# Altium project Sp25-Candle_Maker.PrjPcb
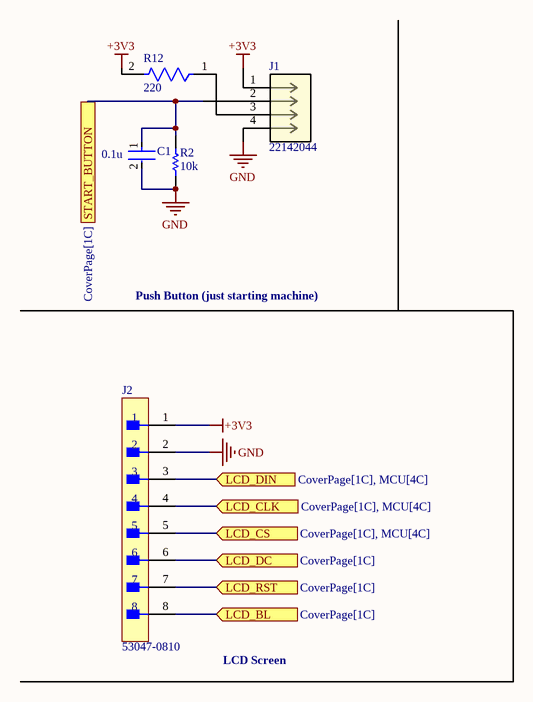
[diagram p0: UI.SchDoc]
5 sheets, 53 parts. Net scope: flat (ports and power ports of the same name join across sheets).
Board file: Candle_Main_PCB.PcbDoc
Sheets:
  UI.SchDoc
  MCU.SchDoc
  VNH5019.SchDoc
  GPIO_EXPANDER_A.SchDoc
  GPIO_EXPANDER_B.SchDoc

## Sheet UI.SchDoc
size A; SheetNumber: 2; SheetTotal: 12

### Parts
C1  0.1u  [FP-CL21-IPC_A]
J1  22142044  [CONN_SDA-4455_04_BE_MOL]
J2  53047-0810  [53047-0810_MFG]
R2  10k  [RESC2013X60X40LL20T25_A]
R12  220  [FP-CRCW0805-e3-MFG]

### Ports
LCD_BL (in, see CoverPage[1C]), LCD_CLK (in, see CoverPage[1C], MCU[4C]), LCD_CS (in, see CoverPage[1C], MCU[4C]), LCD_DC (in, see CoverPage[1C]), LCD_DIN (in, see CoverPage[1C], MCU[4C]), LCD_RST (in, see CoverPage[1C]), START_BUTTON (see CoverPage[1C])

### Nets
+3V3: J1.1 J2.1 R12.2
GND: C1.2 J1.4 J2.2 R2.1
VPSI_CLK: J2.4 ; port LCD_CLK
VSPI_CS: J2.5 ; port LCD_CS
VSPI_MOSI: J2.3 ; port LCD_DIN
NetC1_1: C1.1 J1.2 R2.2 ; port START_BUTTON
NetJ1_3: J1.3 R12.1
NetJ2_6: J2.6 ; port LCD_DC
NetJ2_7: J2.7 ; port LCD_RST
NetJ2_8: J2.8 ; port LCD_BL

### Notes on the sheet
- Push Button (just starting machine)
- LCD Screen

### Library data of the parts
C1 = CMP-13271-000411-1: CL21 Series 0805 100nF 100V ±10% Tolerance X7R Multilayer Ceramic Chip Capacitor
J1 = CMP-129-000000-1: No Description Available; Mfr_Name: Molex Connector Corporation; Design Item ID: 22142044; Type: Type; RefDes: RefDes; Source: 22142044.SchLib
J2 = CMP-00257-00276778-1: Conn Shrouded Header (4 Sides) HDR 8 POS 1.25mm Solder ST Top Entry Thru-Hole PicoBlade Tray; Manufacturer Lifecycle Status: ACTIVE; Gender: Male; Glow Wire Compliant: Non-compliant; Current Rating: 1A; Number of Positions: 8; Contact Resistance: 20mΩ; Insulation Resistance: 100MΩ; Plating: Tin; Voltage Rating (DC): 125V; Number of Circuits: 7; Schedule B: 8536694040, 8536694040; Max Operating Temperature: 85°C; Housing Material: Polyamide; Pitch: 1.25mm; Number of Rows: 1; ComponentLink1URL: http://molex.com; Country of Origin: MX; Case/Package: 0810; Height: 4.4mm; Housing Color: Natural; Flammability Rating: UL94 V-0; Orientation: Vertical; ComponentLink3Description: Manufacturer's Package Drawing; Mount: Through Hole; Min Operating Temperature: -40°C; Number of Pins: 8; Radiation Hardening: No; Contact Plating: Tin; Lead Pitch: 1.25mm; China RoHS: Compliant; ComponentLink1Description: Manufacturer's Website; Lead Free: Lead Free; ComponentLink2Description: Datasheet URL; RoHS: Compliant; Voltage Rating (AC): 125V; ComponentLink3URL: https://www.molex.com/content/dam/molex/molex-dot-com/products/automated/en-us/salesdrawingpdf/530/53047/530470810_sd.pdf?inline; Color: Natural; Number of Contacts: 8; Lifecycle Status: Production; HelpURL: https://www.molex.com/en-us/products/part-detail/530470810#part-details; ComponentLink2URL: https://www.molex.com/en-us/products/part-detail/530470810#part-details; REACH SVHC: Unknown; Contact Material: Tin; Termination: Through Hole; Voltage Rating: 125V
R2 = CMP-2001-00582-2: Metal Film Chip Resistor, High Reliability Type, 0.125 W, +/- 0.1%, -55 to 155 degC, 0805 (2012 Metric), RoHS, Tape and Reel; Voltage Rating: 100V; Power Rating: 125mW(1/8W); Brand: Panasonic; Temperature Coefficient: 25PPM/C; Resistance: 10kOhms; Product Category: ThinFilmResistors-SMD; Datasheet Version: 02/2016; Operating Temperature Range: -55Cto+155C; Length: 2mm; Mounting Technology: SurfaceMount; Manufacturer URL: http://www.panasonic.com/; Width: 1.25mm; Packaging: Reel; Product: ThinFilmResistorsSMD; Package / Case: 0805(2012metric); Termination Style: SMD/SMT; Tolerance: 0.1%; Datasheet URL: https://industrial.panasonic.com/cdbs/www-data/pdf/RDM0000/AOA0000C307.pdf; Package Description: 2-Pin Surface Mount Device, Body 2 x 1.25 mm; Factory Pack Quantity: 5000; Series: ERA-6A; Case Code - mm: 2012; RoHS: Details; Package Reference: 0805; Height: 0.5mm; Manufacturer: Panasonic; Case Code - in: 0805; Type: MetalFilmChipResistors
R12 = CMP-2001-03823-2: RES Thick Film, 330Ω, 1%, 0.125W, 100ppm/°C, 0805; Voltage Rating (DC): 150V; Resistance: 330R; Max Power Dissipation: 125mW; Mount: Surface Mount; Packaging: Tape and Reel; Min Operating Temperature: -55°C; Military Standard: Not; Case Code (Metric): 2012; Height: 0.02inch; Voltage Rating: 150V; Case/Package: 0805; Max Operating Temperature: 155°C; Width: 0.049inch; Case Code (Imperial): 0805; Termination: SMD/SMT; Lead Free: Lead Free; Contact Plating: Tin; Package Quantity: 10; Composition: Thick Film; Length: 2mm; Features: Automotive AEC-Q200; Depth: 1.25mm; Weight: 0.000194oz; Tolerance: 1%; Power Rating: 125mW; Number of Terminations: 2; Temperature Coefficient: 100ppm/°C

## Sheet MCU.SchDoc
size 381 x 241 mm; SheetNumber: 4; SheetTotal: 12
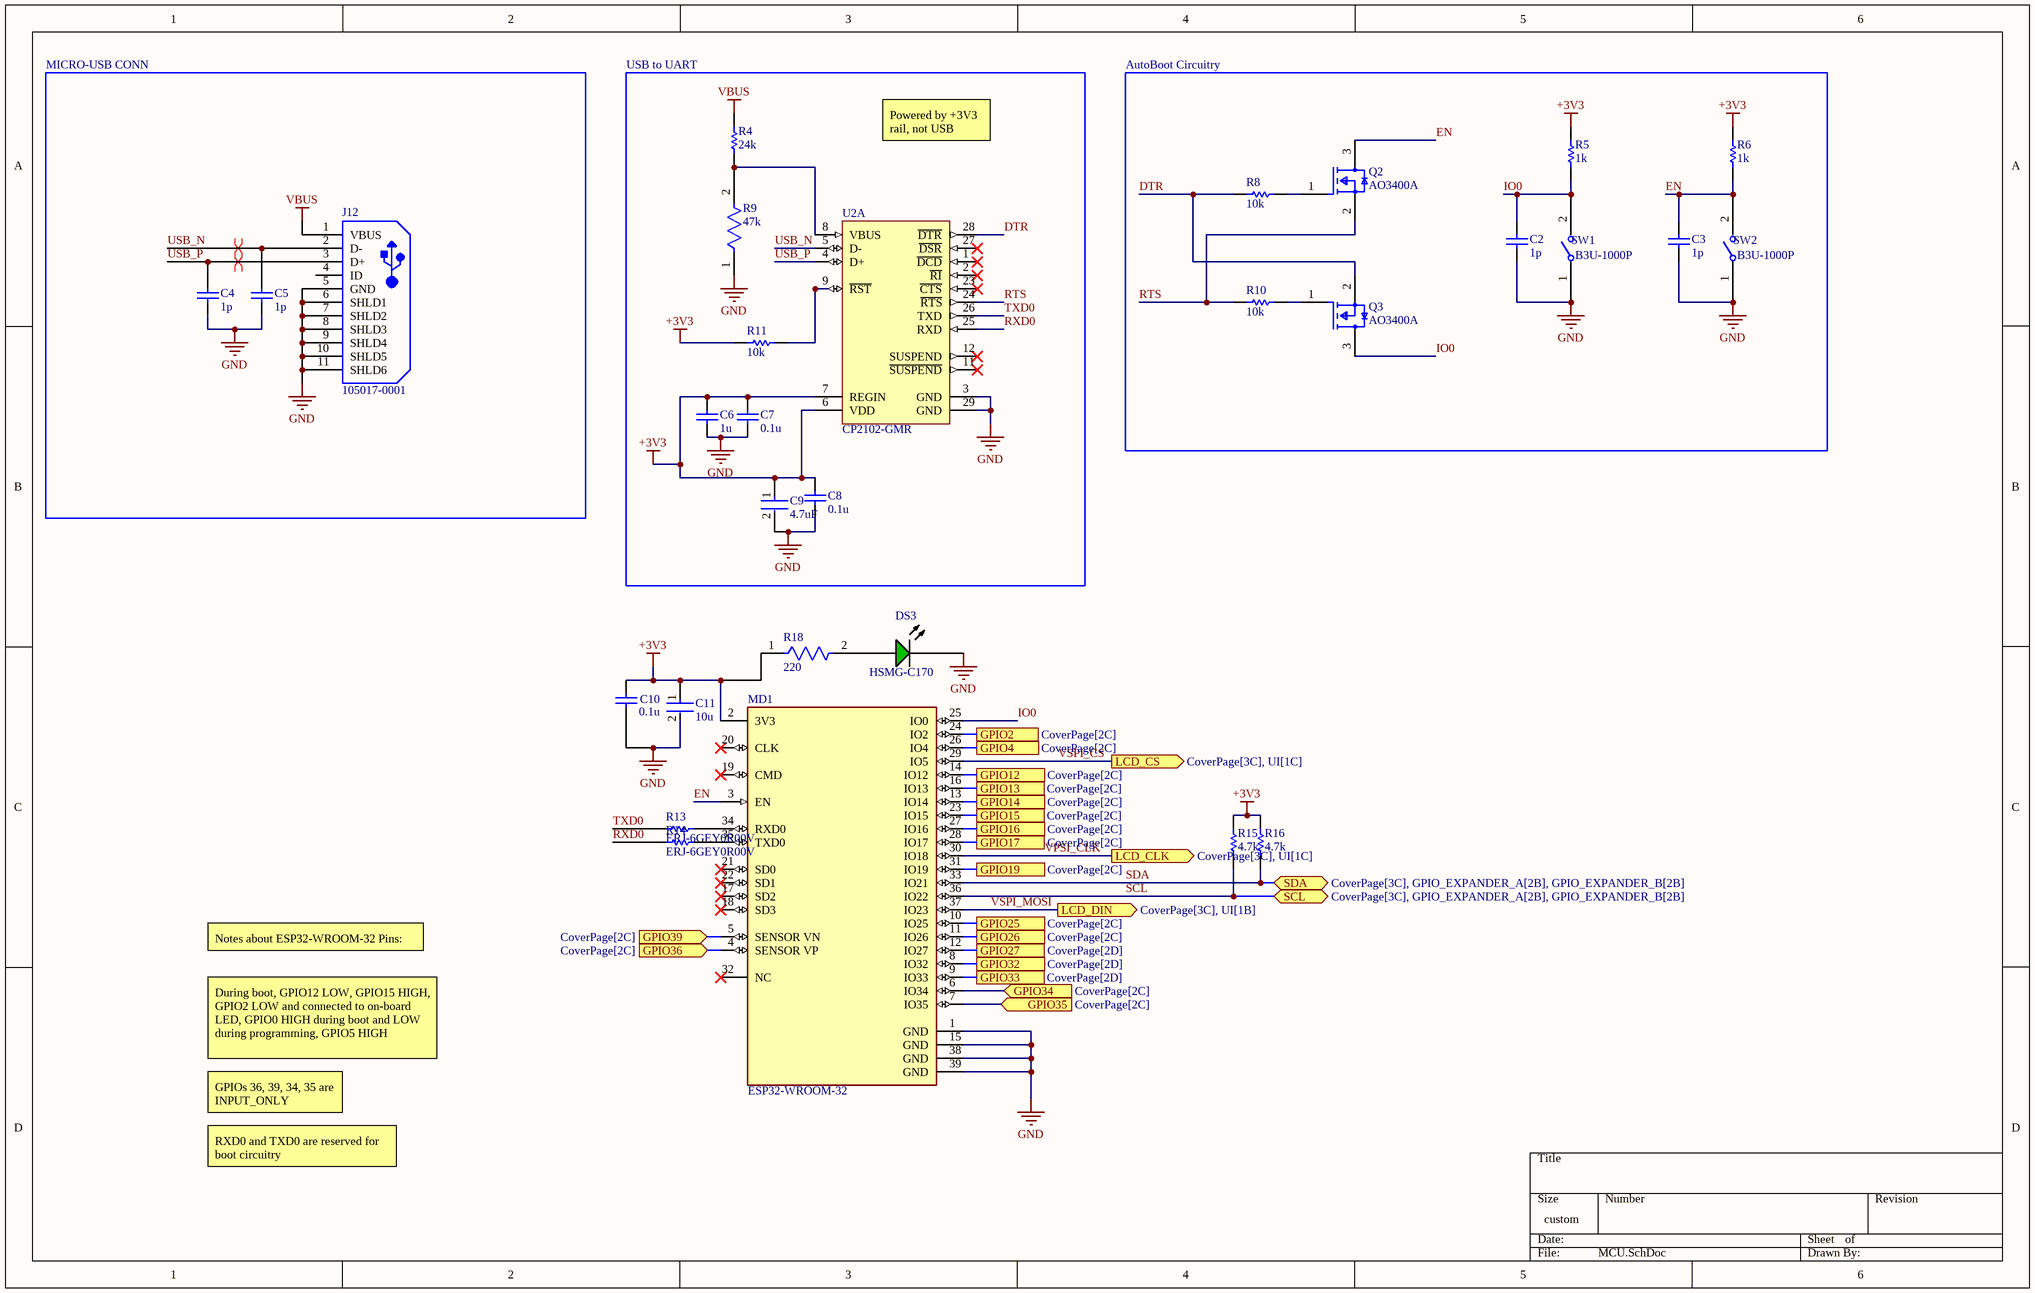
[diagram p1: MCU.SchDoc]

### Parts
C2  1p  [CAPC2013X140X50LL20T25]
C3  1p  [CAPC2013X140X50LL20T25]
C4  1p  [CAPC2013X140X50LL20T25]
C5  1p  [CAPC2013X140X50LL20T25]
C6  1u  [CAPC2013X145X50LL20T25]
C7  0.1u  [CAPC2013X94X50LL20T25]
C8  0.1u  [CAPC2013X94X50LL20T25]
C9  4.7uF  [FP-CL21-IPC_A]
C10  0.1u  [CAPC2013X94X50LL20T25]
C11  10u  [FP-C0805C-DG-MFG]
DS3  HSMG-C170  [AVAG-HSMX-C170_V]
J12  105017-0001  [USB-MICRO-B_V]
MD1  ESP32-WROOM-32  [FP-ESP32-WROOM-32-MFG]
Q2  AO3400A  [FP-SOT23-MFG]
Q3  AO3400A  [FP-SOT23-MFG]
R4  24k  [RESC2013X60X40LL20T25]
R5  1k  [RESC2013X60X35ML10T20]
R6  1k  [RESC2013X60X35ML10T20]
R8  10k  [RESC2013X60X40LL20T25_A]
R9  47k  [FP-ERA6A-MFG]
R10  10k  [RESC2013X60X40LL20T25_A]
R11  10k  [RESC2013X60X40LL20T25_A]
R13  ERJ-6GEY0R00V  [RESC2013X70X40NL20T20]
R14  ERJ-6GEY0R00V  [RESC2013X70X40NL20T20]
R15  4.7k  [YAGO-RC0805_M]
R16  4.7k  [YAGO-RC0805_M]
R18  220  [FP-CRCW0805-e3-MFG]
SW1  B3U-1000P  [FP-B3U-1000P-MFG]
SW2  B3U-1000P  [FP-B3U-1000P-MFG]
U2  CP2102-GMR  [SLAB-QFN-28-3125x3125TP_M]  (part A of 2)

### Blocks framed on the sheet
MICRO-USB CONN: C4 C5 J12
USB to UART: C6-C9 R4 R9 R11 U2
AutoBoot Circuitry: C2 C3 Q2 Q3 R5 R6 R8 R10 SW1 SW2

### Ports
GPIO2 (see CoverPage[2C]), GPIO4 (see CoverPage[2C]), GPIO12 (see CoverPage[2C]), GPIO13 (see CoverPage[2C]), GPIO14 (see CoverPage[2C]), GPIO15 (see CoverPage[2C]), GPIO16 (see CoverPage[2C]), GPIO17 (see CoverPage[2C]), GPIO19 (see CoverPage[2C]), GPIO25 (see CoverPage[2C]), GPIO26 (see CoverPage[2C]), GPIO27 (see CoverPage[2D]), GPIO32 (see CoverPage[2D]), GPIO33 (see CoverPage[2D]), GPIO34 (in, see CoverPage[2C]), GPIO35 (in, see CoverPage[2C]), GPIO36 (in, see CoverPage[2C]), GPIO39 (in, see CoverPage[2C]), LCD_CLK (out, see CoverPage[3C], UI[1C]), LCD_CS (out, see CoverPage[3C], UI[1C]), LCD_DIN (out, see CoverPage[3C], UI[1B]), SCL (bidir, see CoverPage[3C], GPIO_EXPANDER_A[2B], GPIO_EXPANDER_B[2B]), SDA (bidir, see CoverPage[3C], GPIO_EXPANDER_A[2B], GPIO_EXPANDER_B[2B])

### Nets
+3V3: C6.2 C7.2 C8.2 C9.1 C10.2 C11.1 MD1.2(3V3) R5.2 R6.2 R11.1 R15.2 R16.2 R18.1 U2.6(VDD) U2.7(REGIN)
GND: C2.1 C3.1 C4.1 C5.1 C6.1 C7.1 C8.1 C9.2 C10.1 C11.2 DS3.2(K) J12.5(GND) J12.6(SHLD1) J12.7(SHLD2) J12.8(SHLD3) J12.9(SHLD4) J12.10(SHLD5) J12.11(SHLD6) MD1.1(GND) MD1.15(GND) MD1.38(GND) MD1.39(GND) R9.1 SW1.1 SW2.1 U2.3(GND) U2.29(GND)
VBUS: J12.1(VBUS) R4.2
DTR: Q3.2(S) R8.1 U2.28(~{DTR})
EN: C3.2 MD1.3(EN) Q2.3(D) R6.1 SW2.2
IO0: C2.2 MD1.25(IO0) Q3.3(D) R5.1 SW1.2
RTS: Q2.2(S) R10.1 U2.24(~{RTS})
RXD0: R14.1 U2.25(RXD)
SCL: MD1.36(IO22) R15.1 ; port SCL
SDA: MD1.33(IO21) R16.1 ; port SDA
TXD0: R13.1 U2.26(TXD)
USB_N: C5.2 J12.2(D-) U2.5(D-)
USB_P: C4.2 J12.3(D+) U2.4(D+)
VPSI_CLK: MD1.30(IO18) ; port LCD_CLK
VSPI_CS: MD1.29(IO5) ; port LCD_CS
VSPI_MOSI: MD1.37(IO23) ; port LCD_DIN
NetDS3_1: DS3.1(A) R18.2
NetMD1_4: MD1.4(SENSOR_VP) ; port GPIO36
NetMD1_5: MD1.5(SENSOR_VN) ; port GPIO39
NetMD1_6: MD1.6(IO34) ; port GPIO34
NetMD1_7: MD1.7(IO35) ; port GPIO35
NetMD1_8: MD1.8(IO32) ; port GPIO32
NetMD1_9: MD1.9(IO33) ; port GPIO33
NetMD1_10: MD1.10(IO25) ; port GPIO25
NetMD1_11: MD1.11(IO26) ; port GPIO26
NetMD1_12: MD1.12(IO27) ; port GPIO27
NetMD1_13: MD1.13(IO14) ; port GPIO14
NetMD1_14: MD1.14(IO12) ; port GPIO12
NetMD1_16: MD1.16(IO13) ; port GPIO13
NetMD1_23: MD1.23(IO15) ; port GPIO15
NetMD1_24: MD1.24(IO2) ; port GPIO2
NetMD1_26: MD1.26(IO4) ; port GPIO4
NetMD1_27: MD1.27(IO16) ; port GPIO16
NetMD1_28: MD1.28(IO17) ; port GPIO17
NetMD1_31: MD1.31(IO19) ; port GPIO19
NetMD1_34: MD1.34(RXD0) R13.2
NetMD1_35: MD1.35(TXD0) R14.2
NetQ2_1: Q2.1(G) R8.2
NetQ3_1: Q3.1(G) R10.2
NetR4_1: R4.1 R9.2 U2.8(VBUS)
NetR11_2: R11.2 U2.9(~{RST})

Not connected (* = marked no-connect by the designer): J12 4(ID); MD1 17(SD2)* 18(SD3)* 19(CMD)* 20(CLK)* 21(SD0)* 22(SD1)* 32(NC)*; U2 1(~{DCD})* 2(~{RI})* 11(~{SUSPEND})* 12(SUSPEND)* 23(~{CTS})* 27(~{DSR})*

### Layout directives
differential pair: USB_N, USB_P

### Notes on the sheet
- Powered by +3V3 rail, not USB
- Notes about ESP32-WROOM-32 Pins:
- During boot, GPIO12 LOW, GPIO15 HIGH, GPIO2 LOW and connected to on-board LED, GPIO0 HIGH during boot and LOW during programming, GPIO5 HIGH
- GPIOs 36, 39, 34, 35 are INPUT_ONLY
- RXD0 and TXD0 are reserved for boot circuitry

### Library data of the parts
C2-C5 = CMP-1036-00067-2: Part Number: 08055A1R0CAT2A; Manufacturer: AVX Interconnect / Elco
C6 = CMP-1036-04746-2: Manufacturer: Kemet; Part Number: C0805C105K4PACTU
C7 C8 C10 = CMP-2007-04369-1: Manufacturer: AVX Interconnect / Elco; Part Number: 08055C104JAZ2A
C9 = CMP-13271-002624-1: CL21 Series 0805 4.7uF 25V ±10% Tolerance X5R Multilayer Ceramic Chip Capacitor; Case Code (Imperial): 0805; Thickness: 0.055inch; Mount: Surface Mount; Case Code (Metric): 2012; Capacitance: 4.7uF; Depth: 1.25mm; Lead Free: Lead Free; Case/Package: 0805; Voltage Rating: 25V; Package Quantity: 1; Width: 0.049inch; Radiation Hardening: No; Voltage Rating (DC): 25V; Length: 2mm; Dielectric: X5R; Height: 1.25mm; Packaging: Tape and Reel; Tolerance: 10%; Min Operating Temperature: -55°C; Max Operating Temperature: 85°C
C11 = CMP-2007-03243-2: CAP CER 10UF 10V X5R 0805; Manufacturer Part Number: C0805C106K8PACTU; Manufacturer: Kemet; 3DS Part Number: 220-00001; Tolerance: 10%; Temperature Coefficient: 15%; Material: Ceramic; Device Class L2: Capacitors; Device Class L1: Passive Components; ComponentLink2URL: https://content.kemet.com/datasheets/KEM_C1006_X5R_SMD.pdf; Height: 1.4mm; Lead Free: Yes; Digikey Description: CAP CER 10UF 10V X5R 0805; Octopart: https://octopart.com/c0805c106k8pactu-kemet-98697; Capacitance: 10uF; Value: 10uF; Temperature Range Low: -55°C; Temperature: -55°C to +85°C; Automotive: No; Mouser Description: CAP CER 10UF 10V X5R 0805; Ipc Land Pattern Name: CAPC200125X125; Temperature Range High: +85°C; Voltage: 10V; RoHS: TRUE; Device Class L3: Ceramic Capacitors; ComponentLink2Description: Datasheet; Voltage Rating: 10V; Package: C0805C-DG; Temperature Characteristic: X5R; Category: Cap
DS3 = CMP-2000-05062-1: Chip LED, Green, 2.2 V, -40 to 85 degC, 2-Pin SMD, Pb-Free, Tape and Reel; Manufacturer: Avago; No. of Pins: 2; Peak Wavelength: 570nm; SVHC: NoSVHC(16-Jun-2014); Dominant Wavelength: 572nm; Forward Current If: 20mA; Viewing Angle: 170deg; Lens Shape: Rectangular; PIV Max: 5V; External Width: 1.25mm; LED Type: Standard; External Depth: 0.8mm; Opto Mounting Orientation: Top; Luminous Intensity: 15mcd; Luminous Intensity Min: 4mcd; Forward Voltage VF Max: 2.6V; External Length / Height: 2mm; Bulb Size: 1.25mmx1.4mm; Light Area Height: 1mm; Voltage Vf Typ: 2.2V; Operating Temperature Max: 85degC; Datasheet Version: Oct-08; MSL: MSL2A-4weeks; Peak Forward Current: 20mA; Package Description: 2-Pin Surface Mount Device, Body 2 x 1.25 mm, Height 0.8 mm; Datasheet URL: https://datasheet.ciiva.com/29280/180495-da-01-en-chip-led-hsmg-c170-gelb-gruen-29280971.pdf; Storage Temperature Min: -40degC; LED Colour: Green; Wavelength Typ: 570nm; Mounting Type: SMD; Forward Current If Max: 20mA; Dominant Wavelength Typ: 572nm; LED Mounting: SMD; Operating Temperature Range: -30degCto+85degC; Operating Temperature Min: -30degC; Manufacturer URL: http://www.avagotech.com/; Packaging: CutTape; Luminous Intensity Typ: 15mcd; Package Reference: HSMX-C170; Storage Temperature Max: 85degC; Opto Case Style: SMD; Forward Voltage: 2.2V
J12 = CMP-2000-05827-1: Micro-USB B Receptacle, Right Angle, Bottom Mount, Surface Mount, with Solder Tabs, -30 to 85 degC, 5-Pin USB, RoHS, Tape and Reel; Manufacturer: Molex; Featured Product: Micro-USBConnectorsUSBConnectors; Other Names: WM1399DKR; Package Version: Rev. F, 12/2012; Number of Contacts: 5; Connector Type: USB-microB; Catalog Drawings: 1050170001; 3D Model: 105017-0001.stp; Mating Products: WM17145-ND-CABLEMICROUSBBTOSTDA1.0MWM17147-ND-CABLEMICROUSBBTOSTDA2.0MWM17146-ND-CABLEMICROUSBBTOSTDA1.5M; PCN Assembly/Origin: ResinSupplier21/Oct/2015; Voltage - Max: 30V; Online Catalog: Molex-MicroUSB; Manufacturer URL: http://www.molex.com/; Package Description: 5-Leads USB, Micro B, Body 7.5 x 5 mm, Pitch 0.65 mm; Datasheet URL: http://www.molex.com/elqNow/elqRedir.htm?ref=http://www.molex.com/webdocs/datasheets/pdf/en-us/1050170001_IO_CONNECTORS.pdf; Ingress Protection: -; Datasheet Version: 03/2016; Mounting Type: BoardCutout,SurfaceMount,RightAngle; Circuits: 5; Standard Package: 1; Package Reference: MICRO-B; Package URL: http://www.molex.com/pdm_docs/sd/1050170001_sd.pdf; Category: Connectors,Interconnects; Series: -; RoHS Information: 1050170001CertofCompliance; Features: Shielded,SolderRetention; Family: USB,DVI,HDMIConnectors; Specifications: -; Gender: Receptacle; Packaging: Digi-Reel®; Mounting Technology: SurfaceMount
MD1 = CMP-194065-000008-1: RX TXRX MOD WIFI SURFACE MOUNT; Frequency: 2.5GHz; Sensitivity: -98dBm; Operating Supply Voltage: 3.6V; Data Rate: 150Mbps; Weight: 0.088185oz; Package Quantity: 550; Min Operating Temperature: -40°C; Mount: Surface Mount; Max Operating Temperature: 85°C; Packaging: Cut Tape; Case/Package: SMD/SMT
Q2 Q3 = CMP-83955-000006-1: MOSFET N-CH 30V 5.7A SOT23; Input Capacitance: 630pF; Number of Elements: 1; Rds On Max: 26.5mR; Max Power Dissipation: 1.4W; Gate to Source Voltage (Vgs): 12V; Min Operating Temperature: -55°C; Lead Free: Lead Free; Number of Pins: 3; Drain to Source Voltage (Vdss): 30V; Case/Package: SOT-23; Mount: Surface Mount; Continuous Drain Current (ID): 5.7A; Radiation Hardening: No; Packaging: Tape and Reel; Max Operating Temperature: 150°C; Power Dissipation: 1.4W
R4 = CMP-2001-00618-1: Part Number: ERA6AEB243V; Manufacturer: Panasonic
R5 R6 = CMP-2100-03671-1: Chip Resistor, 1 KOhm, +/- 1%, 125 mW, -55 to 155 degC, 0805 (2012 Metric), RoHS, Tape and Reel; Manufacturer: Yageo; Temperature Coefficient: 100ppm/degreesC; Voltage Rating (DC): 150V; Max Power Dissipation: 125mW; Resistance: 1KOhm; Number of Pins: 2; Number of Terminations: 2; Datasheet URL: http://www.yageo.com/NewPortal/yageodocoutput?fileName=/pdf/R-Chip/PYu-RC_Group_51_RoHS_L_5.pdf; Length: 0.079inch; Package Description: 2-Pin Surface Mounted Device, Body 2 x 1.25 mm; Depth: 1.25mm; Height: 0.024inch; Military Standard: Not; Case/Package: 0805; Package Reference: 0805; RoHSCompliant: true; Lead Free: LeadFree; Packaging: TapeandReel; Package Quantity: 1; Datasheet Version: Rev. 5, 10/2016; Tolerance: 1%; Min Operating Temperature: -55degC; Voltage Rating: 150V; Composition: ThickFilm; Case Code (Imperial): 0805; Power Rating: 125mW; Width: 0.049inch; Case Code (Metric): 2012; Manufacturer URL: http://www.yageo.com/; Max Operating Temperature: 155degC; REACH SVHC: Unknown; Termination: SMD/SMT
R8 R10 R11 = CMP-2001-00582-2: as R2 on sheet UI; Product Category: ThinFilmResistors-SMD; Datasheet Version: 02/2016; Operating Temperature Range: -55Cto+155C; Length: 2mm; Mounting Technology: SurfaceMount; Manufacturer URL: http://www.panasonic.com/; Width: 1.25mm; Packaging: Reel; Product: ThinFilmResistorsSMD; Package / Case: 0805(2012metric); Termination Style: SMD/SMT; Tolerance: 0.1%; Datasheet URL: https://industrial.panasonic.com/cdbs/www-data/pdf/RDM0000/AOA0000C307.pdf; Package Description: 2-Pin Surface Mount Device, Body 2 x 1.25 mm; Factory Pack Quantity: 5000; Series: ERA-6A; Case Code - mm: 2012; RoHS: Details; Package Reference: 0805; Height: 0.5mm; Manufacturer: Panasonic; Case Code - in: 0805; Type: MetalFilmChipResistors
R9 = CMP-2001-00645-2: NexarPartId: 1264112; Voltage Rating (DC): 100V; Max Power Dissipation: 125mW; Resistance: 47kΩ; Temperature Coefficient: 25ppm/°C; Tolerance: 0.1%; Case Code (Metric): 2012; Packaging: Cut Tape; Number of Terminations: 2; Max Operating Temperature: 155°C; Height: 500µm; Number of Pins: 2; Min Operating Temperature: -55°C; RoHS: Compliant; Features: Automotive AEC-Q200; Schedule B: 8533210045, 8533210045; Contact Plating: Tin; Case Code (Imperial): 0805; Lead Free: Lead Free; Lifecycle Status: Production; Termination: SMD/SMT; Weight: 5.499807mg; REACH SVHC: No SVHC; Voltage Rating: 100V; Mount: Surface Mount; Radiation Hardening: No; Military Standard: Not; Power Rating: 125mW; Length: 2mm; Depth: 1.25mm; Width: 1.25mm; Composition: Metal Film, Thin Film; Case/Package: 0805
R13 R14 = CMP-1665-00002-5: Chip Resistor, 0 Ohm, +/- 1%, 0.125 W, -55 to 155 degC, 0805 (2012 Metric), RoHS, Tape and Reel; Tolerance: 5%; Resistance: 0 Ohm; REACH SVHC: No SVHC; Min Operating Temperature: -55 degC; Case/Package: 0805; Packaging: Tape and Reel; Package Quantity: 5000; ComponentLink1Description: Manufacturer URL; PackageDescription: 2-Pin Surface Mount Device, Body 2 x 1.25 mm; Mounting Technology: Surface Mount; Max Operating Temperature: 155 degC; PartNumber: ERJ-6GEY0R00V; Width: 1.25 mm; RoHSCompliant: True; Height: 0.6 mm; ComponentLink1URL: http://www.panasonic.com/; ComponentLink2URL: http://industrial.panasonic.com/cdbs/www-data/pdf/RDA0000/AOA0000C84.pdf; Case Code (Imperial): 0805; DatasheetVersion: 03/2015; Length: 2 mm; Case Code (Metric): 2012; ComponentLink2Description: Datasheet; Radiation Hardening: No
R15 R16 = CMP-1568-00001-1: General Puprose Chip Resistor, 4700 Ohm +/- 1%, 0.125 W, -55 to 155 degC, 2-Pin SMD, RoHS, Tape and Reel; PartNumber: RC0805FR-074K7L; Tolerance: +/- 1%; Power: 0.125 W; PackageDescription: 2-Pin Surface Mount Device, Body 2 x 1.25 mm; ComponentLink2URL: http://www.yageo.com/documents/recent/PYu-RC_Group_51_RoHS_L-3.pdf; Temperature Min: -55 degC; Packing: Tape and Reel; Mounting Technology: Surface Mount; ComponentLink1URL: http://www.yageo.com/NewPortal/_en/index.jsp; Resistance: 4700 Ohm; Temperature Max: 155 degC; ComponentLink2Description: Datasheet; DatasheetVersion: Rev. 3; RoHS: TRUE; ComponentLink1Description: Manufacturer URL
R18 = CMP-2001-03823-2: as R12 on sheet UI; Mount: Surface Mount; Packaging: Tape and Reel; Min Operating Temperature: -55°C; Military Standard: Not; Case Code (Metric): 2012; Height: 0.02inch; Voltage Rating: 150V; Case/Package: 0805; Max Operating Temperature: 155°C; Width: 0.049inch; Case Code (Imperial): 0805; Termination: SMD/SMT; Lead Free: Lead Free; Contact Plating: Tin; Package Quantity: 10; Composition: Thick Film; Length: 2mm; Features: Automotive AEC-Q200; Depth: 1.25mm; Weight: 0.000194oz; Tolerance: 1%; Power Rating: 125mW; Number of Terminations: 2; Temperature Coefficient: 100ppm/°C
SW1 SW2 = CMP-2100-03586-2: SWITCH TACTILE SPST-NO 0.05A 12V; Contact Resistance: 100mR; Operating Force: 1.5N; Max Current Rating: 50mA; Switch Travel: 0.15mm; Actuator Type: Standard; Mechanical Life: 200000Cycles; Ratings: Dust Proof; Illumination Type: Non-Illuminated; Throw Configuration: SPST; Actuator Length: 0.4mm; Switch Function: Off-Mom; Height: 1.2mm; Width: 3mm; Weight: 0.000776oz; Contact Material: Silver; Max Voltage Rating (DC): 12V; Insulation Resistance: 100MR; Lead Free: Lead Free; Current Rating: 50mA; Termination: SMD/SMT; Length: 4mm; Voltage Rating (DC): 12V; Contact Current Rating: 50mA; Orientation: Straight; Depth: 2.5mm; Max Operating Temperature: 70°C; Packaging: Tape and Reel; Min Operating Temperature: -25°C; Package Quantity: 1; Mount: Surface Mount; Electrical Life: 200000Cycles
U2 = CMP-2000-04924-1: Single-Chip USB to URAT Bridge, 3.3 V, -40 to 85 degC, 28-Pin QFN, RoHS, Tape and Reel; Manufacturer: Silicon Labs; Interface Circuit Standard 1: RS-232; Transmitter and Receiver FIFO Counter: No; Supply Current: 26mA; Operating Supply Voltage (Min): 3V; Operating Supply Voltage (Typ): 3.3V; Data Rate: 1000kbps; Operating Supply Voltage (Max): 3.6V; Number of Channels: 1; Package URL: http://www.silabs.com/Support%20Documents/TechnicalDocs/C8051T61x.pdf; Operating Temperature (Max): 85C; Datasheet URL: http://www.mouser.com/ds/2/368/CP2102-9-247052.pdf; Operating Temperature Classification: Industrial; Operating Temperature (Min): -40C; Package Description: 28-Pin Quad-Flat No-Leads Package, Body 5 x 5 mm, Pitch 0.5 mm; Manufacturer URL: http://www.silabs.com/; Rad Hardened: No; Package Reference: QFN-28; Pin Count: 28; Packaging: TapeandReel; Mounting: SurfaceMount; Package Type: QFNEP; Datasheet Version: Rev. 1.6, 12/2013

## Sheet VNH5019.SchDoc
size A; SheetNumber: 7; SheetTotal: 12
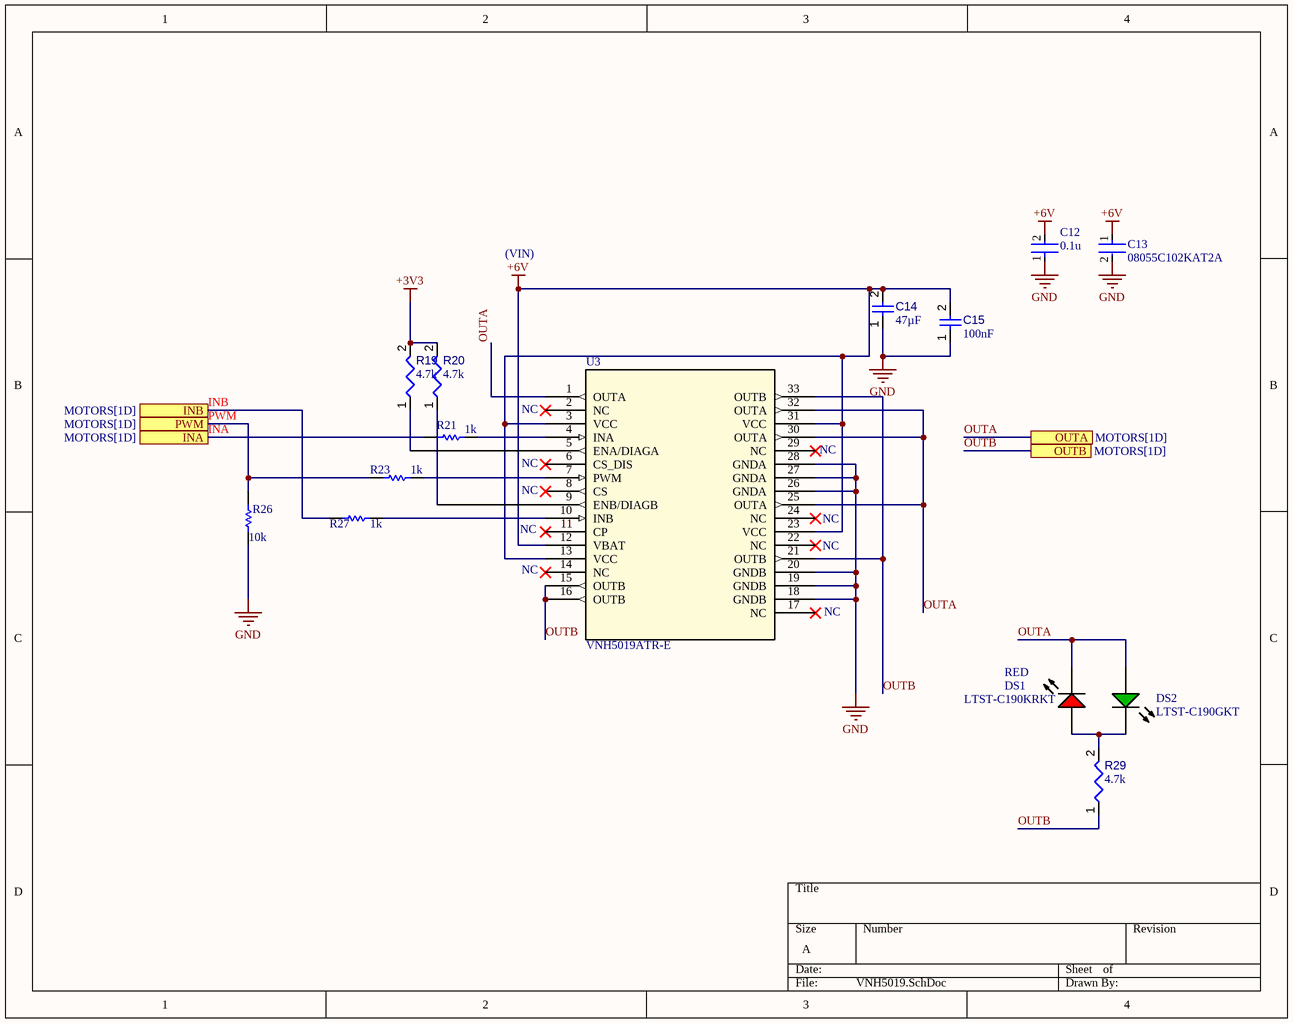
[diagram p2: VNH5019.SchDoc]

### Parts
C12  0.1u  [FP-CL21-IPC_A]
C13  08055C102KAT2A  [FP-0805-L_2_01_0_2-W_1_25-IPC_C]
C14  value 47µF  [CAPC0805(2012)145_L]  (hidden comment: Capacitor 47µF +/-40% 6.3V 0805)
C15  value 100nF  [CAPC2013X95X50LL10T25]  (hidden comment: Capacitor 100 nF +/-10% 50 V 0805)
DS1  LTST-C190KRKT  [LTST-C191KRKT_V]
DS2  LTST-C190GKT  [LTST-C190GKT_V]
R19  value 4.7k  [RESC2013X70X40ML20T20]  (hidden comment: Resistor 4k7 +/-1% 0805 125 mW)
R20  value 4.7k  [RESC2013X70X40ML20T20]  (hidden comment: Resistor 4k7 +/-1% 0805 125 mW)
R21  1k  [RESC2013X60X35ML10T20]
R23  1k  [RESC2013X60X35ML10T20]
R26  10k  [RESC2013X60X40LL20T25_A]
R27  1k  [RESC2013X60X35ML10T20]
R29  value 4.7k  [RESC2013X70X40ML20T20]  (hidden comment: Resistor 4k7 +/-1% 0805 125 mW)
U3  VNH5019ATR-E  [MultiPowerSO-30_STM]

### Ports
INA (see MOTORS[1D]), INB (see MOTORS[1D]), OUTA (see MOTORS[1D]), OUTB (see MOTORS[1D]), PWM (see MOTORS[1D])

### Nets
+3V3: R19.2 R20.2
+6V: C12.2 C13.1 C14.2 C15.2 U3.3(VCC) U3.12(VBAT) U3.13(VCC) U3.23(VCC) U3.31(VCC)
GND: C12.1 C13.2 C14.1 C15.1 R26.1 U3.18(GNDB) U3.19(GNDB) U3.20(GNDB) U3.26(GNDA) U3.27(GNDA) U3.28(GNDA)
OUTA: DS1.2(K) DS2.1(A) U3.1(OUTA) U3.25(OUTA) U3.30(OUTA) U3.32(OUTA) ; port OUTA
OUTB: R29.1 U3.15(OUTB) U3.16(OUTB) U3.21(OUTB) U3.33(OUTB) ; port OUTB
NetDS1_1: DS1.1(A) DS2.2(K) R29.2
NetR19_1: R19.1 U3.5(ENA/DIAGA)
NetR20_1: R20.1 U3.9(ENB/DIAGB)
NetR21_1: R21.1 U3.4(INA)
NetR21_2: R21.2 ; port INA
NetR23_1: R23.1 U3.7(PWM)
NetR23_2: R23.2 R26.2 ; port PWM
NetR27_1: R27.1 U3.10(INB)
NetR27_2: R27.2 ; port INB

Not connected (* = marked no-connect by the designer): U3 2(NC)* 6(CS_DIS)* 8(CS)* 11(CP)* 14(NC)* 17(NC)* 22(NC)* 24(NC)* 29(NC)*

### Notes on the sheet
- (VIN)
- INA
- PWM
- INB
- NC
- (near U3) NC
- (near DS1) RED

### Library data of the parts
C12 = CMP-13271-000411-1: as C1 on sheet UI
C13 = CMP-1036-02979-3: General Purpose Ceramic Capacitor, 0805, 1nF, 10%, X7R, 0.15, 50V; Dissipation Factor: 2.5%; Insulation Resistance: 100GR; Radiation Hardening: No; Case Code (Imperial): 0805; Packaging: Tape and Reel; Height: 0.94mm; Number of Pins: 2; REACH SVHC: No SVHC; Case Code (Metric): 2012; Voltage: 50V; Max Operating Temperature: 125°C; Tolerance: 10%; Voltage Rating: 50V; Depth: 1.25mm; Voltage Rating (DC): 50V; Thickness: 0.037inch; Termination: SMD/SMT; Package Quantity: 1; RoHS Compliant: Yes; Mount: Surface Mount; Dielectric: X7R; Length: 2.01mm; Contact Plating: Tin; Lead Free: Lead Free; Case/Package: 0805; Width: 1.25mm; Capacitance: 1nF; Dielectric Material: Ceramic; Min Operating Temperature: -55°C
C14 = CMP-001-00082-4: Chip Capacitor, 47µF +/-40%, 6.3V, 0805, Thickness 1.45 mm; Tolerance: 10%; Min Operating Temperature: -55°C; Max Operating Temperature: 85°C; Case/Package: 0805; Pins: 2; Mounting Technology: SMT; Voltage Rating: 6.3V
C15 = CMP-001-00018-6: Chip Capacitor, 100 nF, +/- 10%, 50 V, 0805 (2012 Metric); Capacitor Type: Ceramic; Voltage Rating: 50V; Pins: 2; Max Operating Temperature: 125°C; Min Operating Temperature: -55°C; Mounting Technology: SM; Case/Package: 0805; RoHS Compliant: True; Tolerance: 10%
DS1 = CMP-007-00024-2: LED Uni-Color Red, 62.5 mW, 25 mA, -30 to 85 degC, 2-Pin SMD, RoHS, Tape and Reel; Manufacturer: Lite-On; Power: 75mW; Forward Voltage: 2V; Luminous Intensity: 54mcd; Lens Style: Diffused; Viewing Angle: 130degrees; Forward Current: 20mA; Manufacturer URL: http://www.us.liteon.com/; Case/Package: 0603; Datasheet Version: Rev. F, 05/2013; Package Reference: C191KRKT; Datasheet URL: http://optoelectronics.liteon.com/upload/download/DS-22-99-0151/S_110_LTST-C190KRKT.pdf; Package Description: 2-Pin Surface Mount Device, Body 1.6 x 0.8 mm; Nominal Vf: 2V; Packaging: TapeandReel; RoHS Compliant: True; Pins: 2; Illumination Colour: Red; Colour: Red; Mounting Technology: SM; Package Quantity: 3000; Min Operating Temperature: -55°C; Max Operating Temperature: 85°C
DS2 = CMP-007-00022-2: LED Uni-Color Green, 100 mW, 30 mA, -55 to 85 degC, 2-Pin SMD, RoHS, Tape and Reel; Manufacturer: Lite-On; Power: 100mW; Forward Voltage: 2.1V; Viewing Angle: 130degrees; Forward Current: 20mA; Luminous Intensity: 6mcd; Lens Style: Clear; Manufacturer URL: http://www.us.liteon.com/; RoHS Compliant: True; Colour: Green; Package Description: 2-Pin Surface Mount Device, Body 1.6 x 0.8 mm; Datasheet URL: http://datasheet.octopart.com/LTST-C190GKT-Lite-On-datasheet-158530.pdf; Datasheet Version: Dec-06; Mounting Technology: SM; Case/Package: 0603; Package Reference: C190GKT; Packaging: TapeandReel; Min Operating Temperature: -55°C; Nominal Vf: 2.1V; Package Quantity: 3000; Illumination Colour: Green; Max Operating Temperature: 85°C; Pins: 2
R19 R20 R29 = CMP-009-00032-5: Chip Resistor, 4.7 KOhm, +/- 1%, 0.125 W, -55 to 155 degC, 0805 (2012 Metric); Power: 125mW; Voltage Rating: 150V; Max Operating Temperature: 155°C; Min Operating Temperature: -55°C; Case/Package: 0805; RoHS Compliant: True; Pins: 2; Tolerance: 1%; Mounting Technology: SM
R21 R23 R27 = CMP-2100-03671-1: as R5 on sheet MCU; Number of Pins: 2; Number of Terminations: 2; Datasheet URL: http://www.yageo.com/NewPortal/yageodocoutput?fileName=/pdf/R-Chip/PYu-RC_Group_51_RoHS_L_5.pdf; Length: 0.079inch; Package Description: 2-Pin Surface Mounted Device, Body 2 x 1.25 mm; Depth: 1.25mm; Height: 0.024inch; Military Standard: Not; Case/Package: 0805; Package Reference: 0805; RoHSCompliant: true; Lead Free: LeadFree; Packaging: TapeandReel; Package Quantity: 1; Datasheet Version: Rev. 5, 10/2016; Tolerance: 1%; Min Operating Temperature: -55degC; Voltage Rating: 150V; Composition: ThickFilm; Case Code (Imperial): 0805; Power Rating: 125mW; Width: 0.049inch; Case Code (Metric): 2012; Manufacturer URL: http://www.yageo.com/; Max Operating Temperature: 155degC; REACH SVHC: Unknown; Termination: SMD/SMT
R26 = CMP-2001-00582-2: as R2 on sheet UI; Product Category: ThinFilmResistors-SMD; Datasheet Version: 02/2016; Operating Temperature Range: -55Cto+155C; Length: 2mm; Mounting Technology: SurfaceMount; Manufacturer URL: http://www.panasonic.com/; Width: 1.25mm; Packaging: Reel; Product: ThinFilmResistorsSMD; Package / Case: 0805(2012metric); Termination Style: SMD/SMT; Tolerance: 0.1%; Datasheet URL: https://industrial.panasonic.com/cdbs/www-data/pdf/RDM0000/AOA0000C307.pdf; Package Description: 2-Pin Surface Mount Device, Body 2 x 1.25 mm; Factory Pack Quantity: 5000; Series: ERA-6A; Case Code - mm: 2012; RoHS: Details; Package Reference: 0805; Height: 0.5mm; Manufacturer: Panasonic; Case Code - in: 0805; Type: MetalFilmChipResistors
U3 = CMP-120-000003-2: No Description Available; Mfr_Name: STMicroelectronics; Design Item ID: VNH5019ATR-E; Type: Type; Source: VNH5019ATR-E.SchLib; RefDes: RefDes; Pin Count: 33; Component Type: Standard

## Sheet GPIO_EXPANDER_A.SchDoc
size A; SheetNumber: 8; SheetTotal: 12
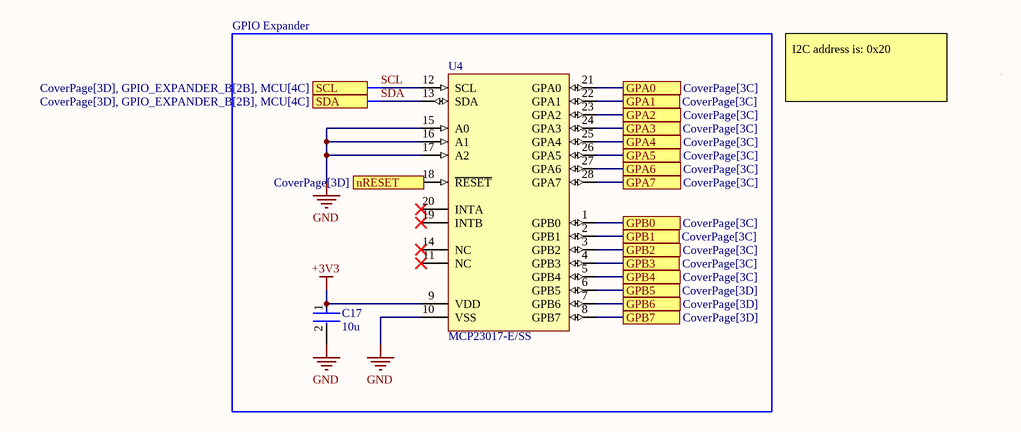
[diagram p3: GPIO_EXPANDER_A.SchDoc]

### Parts
C17  10u  [FP-C0805C-DG-MFG]
U4  MCP23017-E/SS  [SSOP-SS28_N]

### Ports
GPA0 (see CoverPage[3C]), GPA1 (see CoverPage[3C]), GPA2 (see CoverPage[3C]), GPA3 (see CoverPage[3C]), GPA4 (see CoverPage[3C]), GPA5 (see CoverPage[3C]), GPA6 (see CoverPage[3C]), GPA7 (see CoverPage[3C]), GPB0 (see CoverPage[3C]), GPB1 (see CoverPage[3C]), GPB2 (see CoverPage[3C]), GPB3 (see CoverPage[3C]), GPB4 (see CoverPage[3C]), GPB5 (see CoverPage[3D]), GPB6 (see CoverPage[3D]), GPB7 (see CoverPage[3D]), nRESET (in, see CoverPage[3D]), SCL (see CoverPage[3D], GPIO_EXPANDER_B[2B], MCU[4C]), SDA (see CoverPage[3D], GPIO_EXPANDER_B[2B], MCU[4C])

### Nets
+3V3: C17.1 U4.9(VDD)
GND: C17.2 U4.10(VSS) U4.15(A0) U4.16(A1) U4.17(A2)
SCL: U4.12(SCL) ; port SCL
SDA: U4.13(SDA) ; port SDA
NetU4_1: U4.1(GPB0) ; port GPB0
NetU4_2: U4.2(GPB1) ; port GPB1
NetU4_3: U4.3(GPB2) ; port GPB2
NetU4_4: U4.4(GPB3) ; port GPB3
NetU4_5: U4.5(GPB4) ; port GPB4
NetU4_6: U4.6(GPB5) ; port GPB5
NetU4_7: U4.7(GPB6) ; port GPB6
NetU4_8: U4.8(GPB7) ; port GPB7
NetU4_21: U4.21(GPA0) ; port GPA0
NetU4_22: U4.22(GPA1) ; port GPA1
NetU4_23: U4.23(GPA2) ; port GPA2
NetU4_24: U4.24(GPA3) ; port GPA3
NetU4_25: U4.25(GPA4) ; port GPA4
NetU4_26: U4.26(GPA5) ; port GPA5
NetU4_27: U4.27(GPA6) ; port GPA6
NetU4_28: U4.28(GPA7) ; port GPA7

Not connected (* = marked no-connect by the designer): U4 11(NC)* 14(NC)* 18(~{RESET}) 19(INTB)* 20(INTA)*

### Notes on the sheet
- GPIO Expander
- I2C address is: 0x20
- Type @ to refer to a designator or a net

### Library data of the parts
C17 = CMP-2007-03243-2: as C11 on sheet MCU; Device Class L2: Capacitors; Device Class L1: Passive Components; ComponentLink2URL: https://content.kemet.com/datasheets/KEM_C1006_X5R_SMD.pdf; Height: 1.4mm; Lead Free: Yes; Digikey Description: CAP CER 10UF 10V X5R 0805; Octopart: https://octopart.com/c0805c106k8pactu-kemet-98697; Capacitance: 10uF; Value: 10uF; Temperature Range Low: -55°C; Temperature: -55°C to +85°C; Automotive: No; Mouser Description: CAP CER 10UF 10V X5R 0805; Ipc Land Pattern Name: CAPC200125X125; Temperature Range High: +85°C; Voltage: 10V; RoHS: TRUE; Device Class L3: Ceramic Capacitors; ComponentLink2Description: Datasheet; Voltage Rating: 10V; Package: C0805C-DG; Temperature Characteristic: X5R; Category: Cap
U4 = CMP-0186-00176-2: 16-Bit I/O Expander with Serial Interface, 28-Pin SSOP, Extended Temperature; PackageVersion: revBB, Aug-2009; ComponentLink1Description: Manufacturer URL; ComponentLink3Description: Package Specification; PackageDescription: 28-Lead Plastic Shrink Small Outline (SS) - 5.3mm Body [SSOP]; ComponentLink1URL: http://www.microchip.com/; Code_JEDEC: MS-150; RevisionNote: URLs added.; ComponentLink3URL: http://www.microchip.com/stellent/groups/techpub_sg/documents/packagingspec/en012702.pdf; ComponentLink2URL: http://ww1.microchip.com/downloads/en/DeviceDoc/21952b.pdf; ComponentLink2Description: Datasheet; PackageReference: SSOP-SS28; DatasheetVersion: revB, Feb-2007

## Sheet GPIO_EXPANDER_B.SchDoc
size A; SheetNumber: 9; SheetTotal: 12
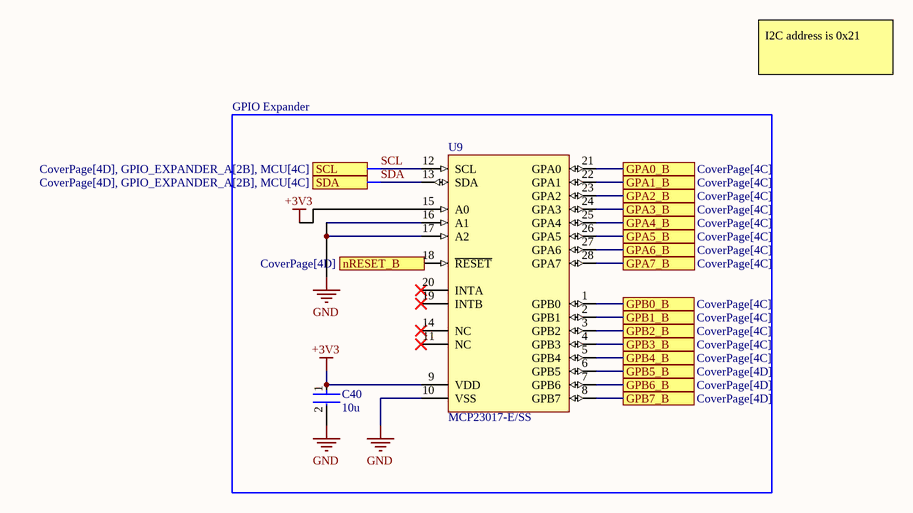
[diagram p4: GPIO_EXPANDER_B.SchDoc]

### Parts
C40  10u  [FP-C0805C-DG-MFG]
U9  MCP23017-E/SS  [SSOP-SS28_N]

### Ports
GPA0_B (see CoverPage[4C]), GPA1_B (see CoverPage[4C]), GPA2_B (see CoverPage[4C]), GPA3_B (see CoverPage[4C]), GPA4_B (see CoverPage[4C]), GPA5_B (see CoverPage[4C]), GPA6_B (see CoverPage[4C]), GPA7_B (see CoverPage[4C]), GPB0_B (see CoverPage[4C]), GPB1_B (see CoverPage[4C]), GPB2_B (see CoverPage[4C]), GPB3_B (see CoverPage[4C]), GPB4_B (see CoverPage[4C]), GPB5_B (see CoverPage[4D]), GPB6_B (see CoverPage[4D]), GPB7_B (see CoverPage[4D]), nRESET_B (in, see CoverPage[4D]), SCL (see CoverPage[4D], GPIO_EXPANDER_A[2B], MCU[4C]), SDA (see CoverPage[4D], GPIO_EXPANDER_A[2B], MCU[4C])

### Nets
+3V3: C40.1 U9.9(VDD) U9.15(A0)
GND: C40.2 U9.10(VSS) U9.16(A1) U9.17(A2)
SCL: U9.12(SCL) ; port SCL
SDA: U9.13(SDA) ; port SDA
NetU9_1: U9.1(GPB0) ; port GPB0_B
NetU9_2: U9.2(GPB1) ; port GPB1_B
NetU9_3: U9.3(GPB2) ; port GPB2_B
NetU9_4: U9.4(GPB3) ; port GPB3_B
NetU9_5: U9.5(GPB4) ; port GPB4_B
NetU9_6: U9.6(GPB5) ; port GPB5_B
NetU9_7: U9.7(GPB6) ; port GPB6_B
NetU9_8: U9.8(GPB7) ; port GPB7_B
NetU9_21: U9.21(GPA0) ; port GPA0_B
NetU9_22: U9.22(GPA1) ; port GPA1_B
NetU9_23: U9.23(GPA2) ; port GPA2_B
NetU9_24: U9.24(GPA3) ; port GPA3_B
NetU9_25: U9.25(GPA4) ; port GPA4_B
NetU9_26: U9.26(GPA5) ; port GPA5_B
NetU9_27: U9.27(GPA6) ; port GPA6_B
NetU9_28: U9.28(GPA7) ; port GPA7_B

Not connected (* = marked no-connect by the designer): U9 11(NC)* 14(NC)* 18(~{RESET}) 19(INTB)* 20(INTA)*

### Notes on the sheet
- GPIO Expander
- I2C address is 0x21

### Library data of the parts
C40 = CMP-2007-03243-2: as C11 on sheet MCU; Device Class L2: Capacitors; Device Class L1: Passive Components; ComponentLink2URL: https://content.kemet.com/datasheets/KEM_C1006_X5R_SMD.pdf; Height: 1.4mm; Lead Free: Yes; Digikey Description: CAP CER 10UF 10V X5R 0805; Octopart: https://octopart.com/c0805c106k8pactu-kemet-98697; Capacitance: 10uF; Value: 10uF; Temperature Range Low: -55°C; Temperature: -55°C to +85°C; Automotive: No; Mouser Description: CAP CER 10UF 10V X5R 0805; Ipc Land Pattern Name: CAPC200125X125; Temperature Range High: +85°C; Voltage: 10V; RoHS: TRUE; Device Class L3: Ceramic Capacitors; ComponentLink2Description: Datasheet; Voltage Rating: 10V; Package: C0805C-DG; Temperature Characteristic: X5R; Category: Cap
U9 = CMP-0186-00176-2: as U4 on sheet GPIO_EXPANDER_A; PackageVersion: revBB, Aug-2009; ComponentLink1Description: Manufacturer URL; ComponentLink3Description: Package Specification; PackageDescription: 28-Lead Plastic Shrink Small Outline (SS) - 5.3mm Body [SSOP]; ComponentLink1URL: http://www.microchip.com/; Code_JEDEC: MS-150; RevisionNote: URLs added.; ComponentLink3URL: http://www.microchip.com/stellent/groups/techpub_sg/documents/packagingspec/en012702.pdf; ComponentLink2URL: http://ww1.microchip.com/downloads/en/DeviceDoc/21952b.pdf; ComponentLink2Description: Datasheet; PackageReference: SSOP-SS28; DatasheetVersion: revB, Feb-2007

## Nets that join several sheets
+3V3: UI (J1.1 J2.1 R12.2), MCU (15 pins), VNH5019 (R19.2 R20.2), GPIO_EXPANDER_A (C17.1 U4.9), GPIO_EXPANDER_B (C40.1 U9.9 U9.15)
GND: UI (C1.2 J1.4 J2.2 R2.1), MCU (27 pins), VNH5019 (11 pins), GPIO_EXPANDER_A (5 pins), GPIO_EXPANDER_B (C40.2 U9.10 U9.16 U9.17)
SCL: MCU (MD1.36 R15.1), GPIO_EXPANDER_A (U4.12), GPIO_EXPANDER_B (U9.12)
SDA: MCU (MD1.33 R16.1), GPIO_EXPANDER_A (U4.13), GPIO_EXPANDER_B (U9.13)
VPSI_CLK: UI (J2.4), MCU (MD1.30)
VSPI_CS: UI (J2.5), MCU (MD1.29)
VSPI_MOSI: UI (J2.3), MCU (MD1.37)